# EAGLE schematic Motor-Driver-Module v14 (EAGLE 9.7.0)
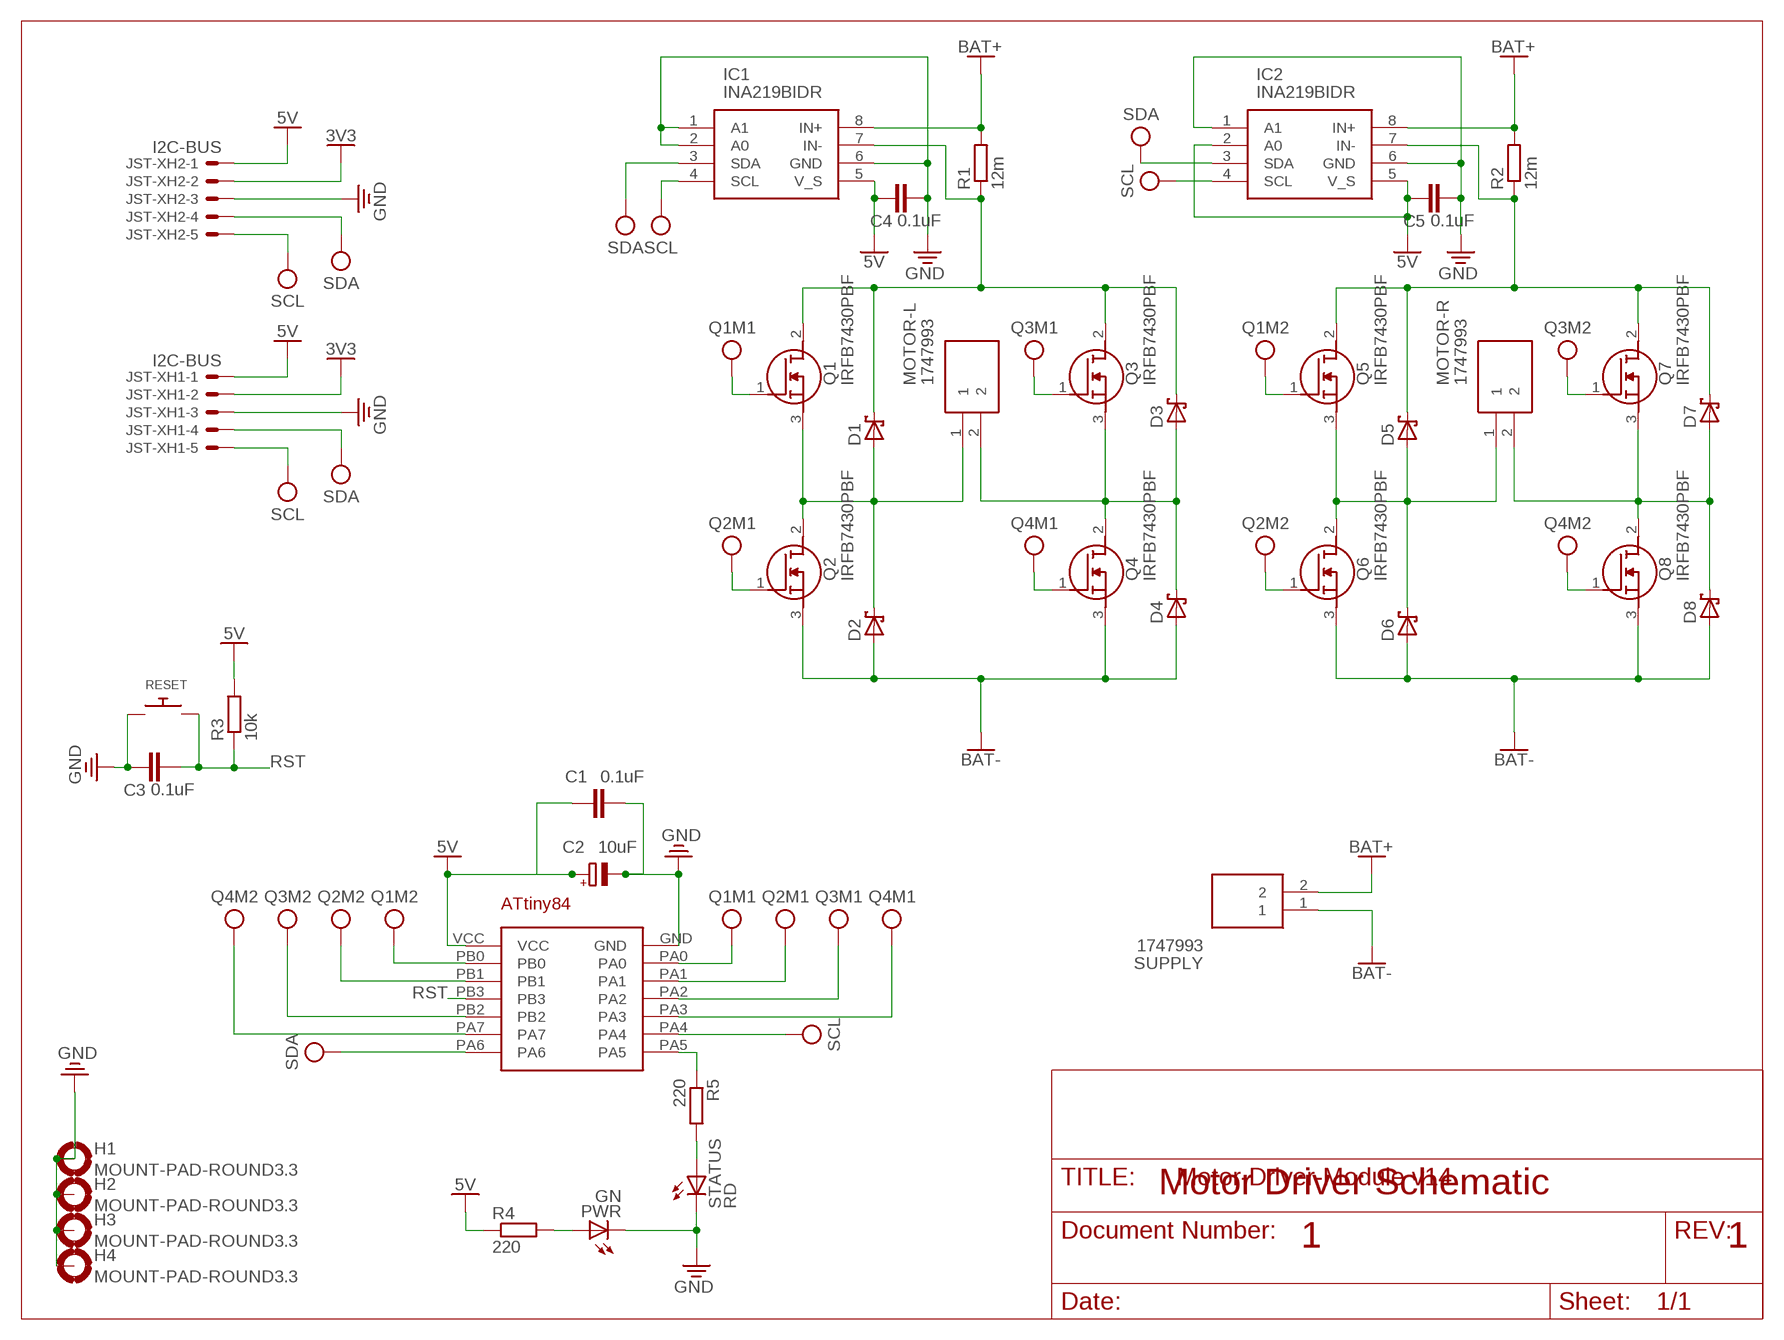
[diagram p0: schematic, sheet 1]

## Parts
C1  0.1uF  C-EU025-025X050  [C025-025X050]
C2  10uF  CPOL-EUE5-10.5  [E5-10,5]
C3  0.1uF  C-EU025-030X050  [C025-030X050]
C4  0.1uF  C-EU025-030X050  [C025-030X050]
C5  0.1uF  C-EU025-030X050  [C025-030X050]
D1  SCHOTTKY-DIODEDO41  [DO41-10]
D2  SCHOTTKY-DIODEDO41  [DO41-10]
D3  SCHOTTKY-DIODEDO41  [DO41-10]
D4  SCHOTTKY-DIODEDO41  [DO41-10]
D5  SCHOTTKY-DIODEDO41  [DO41-10]
D6  SCHOTTKY-DIODEDO41  [DO41-10]
D7  SCHOTTKY-DIODEDO41  [DO41-10]
D8  SCHOTTKY-DIODEDO41  [DO41-10]
H1  MOUNT-PAD-ROUND3.3  [3,3-PAD]
H2  MOUNT-PAD-ROUND3.3  [3,3-PAD]
H3  MOUNT-PAD-ROUND3.3  [3,3-PAD]
H4  MOUNT-PAD-ROUND3.3  [3,3-PAD]
IC1  INA219BIDR  [SOIC127P600X175-8N]
IC2  INA219BIDR  [SOIC127P600X175-8N]
JST-XH1  I2C-BUS  JST-XH-05-PIN-LONG-PAD  [JST-XH-05-PACKAGE-LONG-PAD]
JST-XH2  I2C-BUS  JST-XH-05-PIN-LONG-PAD  [JST-XH-05-PACKAGE-LONG-PAD]
MOTOR-L  1747993  [1747993]
MOTOR-R  1747993  [1747993]
PWR  GN  LED5MM  [LED5MM]
Q1  IRFB7430PBF  [TO254P483X1016X1994-3P]
Q2  IRFB7430PBF  [TO254P483X1016X1994-3P]
Q3  IRFB7430PBF  [TO254P483X1016X1994-3P]
Q4  IRFB7430PBF  [TO254P483X1016X1994-3P]
Q5  IRFB7430PBF  [TO254P483X1016X1994-3P]
Q6  IRFB7430PBF  [TO254P483X1016X1994-3P]
Q7  IRFB7430PBF  [TO254P483X1016X1994-3P]
Q8  IRFB7430PBF  [TO254P483X1016X1994-3P]
R1  12m  R-EU_0204/7  [0204/7]
R2  12m  R-EU_0204/7  [0204/7]
R3  10k  R-EU_0204/7  [0204/7]
R4  220  R-EU_0204/7  [0204/7]
R5  220  R-EU_0204/7  [0204/7]
RESET  SWITCH_PUSHBUTTONEVQ-PE  [TACT_PANA-EVQ]
STATUS  RD  LED5MM  [LED5MM]
SUPPLY  1747993  [1747993]
U$1  ATTINY84DIP  [ATTINY84(DIP)]

## Nets
3V3: JST-XH1.2 JST-XH2.2
5V: C1.1 C2.+ C4.1 C5.1 IC1.5(V_S) IC2.2(A0) IC2.5(V_S) JST-XH1.1 JST-XH2.1 R3.2 R4.1 U$1.VCC
BAT+: IC1.8(IN+) IC2.8(IN+) R1.2 R2.2 SUPPLY.2
BAT-: D2.A D4.A D6.A D8.A Q2.3(S) Q4.3(S) Q6.3(S) Q8.3(S) SUPPLY.1
GND: C1.2 C2.- C3.1 C4.2 C5.2 H1.B3,3(MOUNT) H2.B3,3(MOUNT) H3.B3,3(MOUNT) H4.B3,3(MOUNT) IC1.1(A1) IC1.2(A0) IC1.6(GND) IC2.1(A1) IC2.6(GND) JST-XH1.3 JST-XH2.3 PWR.K(C) RESET.P$1 STATUS.K(C) U$1.GND
N$1: D3.A D4.C MOTOR-L.2 Q3.3(S) Q4.2(D)
N$2: D1.A D2.C MOTOR-L.1 Q1.3(S) Q2.2(D)
N$3: D7.A D8.C MOTOR-R.2 Q7.3(S) Q8.2(D)
N$4: D5.A D6.C MOTOR-R.1 Q5.3(S) Q6.2(D)
N$5: D1.C D3.C IC1.7(IN-) Q1.2(D) Q3.2(D) R1.1
N$6: D5.C D7.C IC2.7(IN-) Q5.2(D) Q7.2(D) R2.1
N$7: R5.1 U$1.PA5
N$8: R5.2 STATUS.A
N$9: PWR.A R4.2
Q1M1: Q1.1(G) U$1.PA0
Q1M2: Q5.1(G) U$1.PB0
Q2M1: Q2.1(G) U$1.PA1
Q2M2: Q6.1(G) U$1.PB1
Q3M1: Q3.1(G) U$1.PA2
Q3M2: Q7.1(G) U$1.PB2
Q4M1: Q4.1(G) U$1.PA3
Q4M2: Q8.1(G) U$1.PA7
RST: C3.2 R3.1 RESET.P$2 U$1.PB3
SCL: IC1.4(SCL) IC2.4(SCL) JST-XH1.5 JST-XH2.5 U$1.PA4
SDA: IC1.3(SDA) IC2.3(SDA) JST-XH1.4 JST-XH2.4 U$1.PA6

## Notes on the sheet
- Motor Driver Schematic
- 1 | 1

## Library data of the parts
C1 C3-C5 = rcl:C-EU: CAPACITOR, European symbol; SPICEPREFIX: C
C2 = rcl:CPOL-EU: POLARIZED CAPACITOR, European symbol; SPICEPREFIX: C
D1-D8 = adafruit:SCHOTTKY-DIODE: Schottky Diode
H1-H4 = holes:MOUNT-PAD-ROUND: MOUNTING PAD, round
IC1 IC2 = SamacSys_Parts:INA219BIDR: 26-V, Bidirectional, Zero-Drift, High-Side, I2C Out Current/Power Monitor Source: Datasheet <https://www.ti.com/lit/ds/symlink/ina219.pdf?HQS=TI-null-null-digikeymode-df-pf-null-wwe&ts=1601223553719>; DESCRIPTION: 26-V, Bidirectional, Zero-Drift, High-Side, I2C Out Current/Power Monitor; HEIGHT: 1.75mm; MANUFACTURER_NAME: Texas Instruments; MANUFACTURER_PART_NUMBER: INA219BIDR; MOUSER_PART_NUMBER: 595-INA219BIDR; MOUSER_PRICE-STOCK: https://www.mouser.co.uk/ProductDetail/Texas-Instruments/INA219BIDR?qs=1WmUhT%2FVMINyGsXNJcdD5Q%3D%3D
JST-XH1 JST-XH2 = Rembrandt Electronics - JST XH Connectors v1-0:JST-XH-05-PIN: JST XH Connector 2 Pin Wire to board connector. Pitch: 2,54 mm, (0.100") Number of pins: 5 Created by Rembrandt Electronics www.rembrandtelectronics.com
MOTOR-L MOTOR-R SUPPLY = SamacSys_Parts:1747993: PCB header, nominal cross section: 2.5 mm?, color: green, nominal current: 12 A, rated voltage (III/2): 320 V, contact surface: Gold, type of contact: Male connector, Number of potentials: 2, Number of rows: 1, Number of positions per row: 2, number of connections: 2, product range: MSTBVA 2,5/..-G, pitch: 5.08 mm, mounting: Wave soldering, pin layout: Linear pinning, solder pin [P]: 3.9 mm, Stecksystem: CLASSIC COMBICON, Locking: without, type of packaging: packed in cardboard Source: Datasheet <http://www.phoenixcontact.com/de/produkte/1747993/pdf>; DESCRIPTION: PCB header, nominal cross section: 2.5 mm?, color: green, nominal current: 12 A, rated voltage (III/2): 320 V, contact surface: Gold, type of contact: Male connector, Number of potentials: 2, Number of rows: 1, Number of positions per row: 2, number of connections: 2, product range: MSTBVA 2,5/..-G, pitch: 5.08 mm, mounting: Wave soldering, pin layout: Linear pinning, solder pin [P]: 3.9 mm, Stecksystem: CLASSIC COMBICON, Locking: without, type of packaging: packed in cardboard; HEIGHT: 12.15mm; MANUFACTURER_NAME: Phoenix Contact; MANUFACTURER_PART_NUMBER: 1747993; MOUSER_PART_NUMBER: 651-1747993; MOUSER_PRICE-STOCK: https://www.mouser.co.uk/ProductDetail/Phoenix-Contact/1747993?qs=cq3Rj917t3li0%2FrJTXaRgg%3D%3D
PWR STATUS = adafruit:LED: LED OSRAM: - CHIPLED LG R971, LG N971, LY N971, LG Q971, LY Q971, LO R971, LY R971 LH N974, LH R974 LS Q976, LO Q976, LY Q976 LO Q996 - Hyper CHIPLED LW Q18S LB Q993, LB Q99A, LB R99A - SideLED LS A670, LO A670, LY A670, LG A670, LP A670 LB A673, LV A673, LT A673, LW A673 LH A674 LY A675 LS A676, LA A676, LO A676, LY A676, LW A676 LS A679, LY A679, LG A679 - Hyper Micro SIDELED® LS Y876, LA Y876, LO Y876, LY Y876 LT Y87S - SmartLED LW L88C, LW L88S LB L89C, LB L89S, LG L890 LS L89K, LO L89K, LY L89K LS L896, LA L896, LO L896, LY L896 - TOPLED LS T670, LO T670, LY T670, LG T670, LP T670 LSG T670, LSP T670, LSY T670, LOP T670, LYG T670 LG T671, LOG T671, LSG T671 LB T673, LV T673, LT T673, LW T673 LH T674 LS T676, LA T676, LO T676, LY T676, LB T676, LH T676, LSB T676, LW T676 LB T67C, LV T67C, LT T67C, LS T67K, LO T67K, LY T67K, LW E67C LS E67B, LA E67B, LO E67B, LY E67B, LB E67C, LV E67C, LT E67C LW T67C LS T679, LY T679, LG T679 LS T770, LO T770, LY T770, LG T770, LP T770 LB T773, LV T773, LT T773, LW T773 LH T774 LS E675, LA E675, LY E675, LS T675 LS T776, LA T776, LO T776, LY T776, LB T776 LHGB T686 LT T68C, LB T68C - Hyper Mini TOPLED® LB M676 - Mini TOPLED Santana® LG M470 LS M47K, LO M47K, LY M47K Source: http://www.osram.convergy.de/
Q1-Q8 = SamacSys_Parts:IRFB7430PBF: Infineon IRFB7430PBF N-channel MOSFET, 195 A, 40 V StrongIRFET, 3-Pin TO-220AB Source: Datasheet <https://componentsearchengine.com/Datasheets/2/IRFB7430PBF.pdf>; DESCRIPTION: Infineon IRFB7430PBF N-channel MOSFET, 195 A, 40 V StrongIRFET, 3-Pin TO-220AB; HEIGHT: 4.83mm; MANUFACTURER_NAME: Infineon; MANUFACTURER_PART_NUMBER: IRFB7430PBF; MOUSER_PART_NUMBER: 942-IRFB7430PBF; MOUSER_PRICE-STOCK: https://www.mouser.co.uk/ProductDetail/Infineon-Technologies/IRFB7430PBF?qs=PRpJrl6HpdwkCaEhLAouSA%3D%3D
R1-R5 = rcl:R-EU_: RESISTOR, European symbol; SPICEPREFIX: R
RESET = adafruit:SWITCH_PUSHBUTTON: Buttons SOFTTOUCHSMD_SJ - Soft touch temporary push button (Super Junk Akihabara) Compatible with SKPMANE010 [Mouser: 688-SKPMAN] C&K_KSS = Digikey: KSS221GLFS
U$1 = RobotMower_Eagle_Library:ATTINY84